# EAGLE schematic nets_v2 (EAGLE 9.6.2)
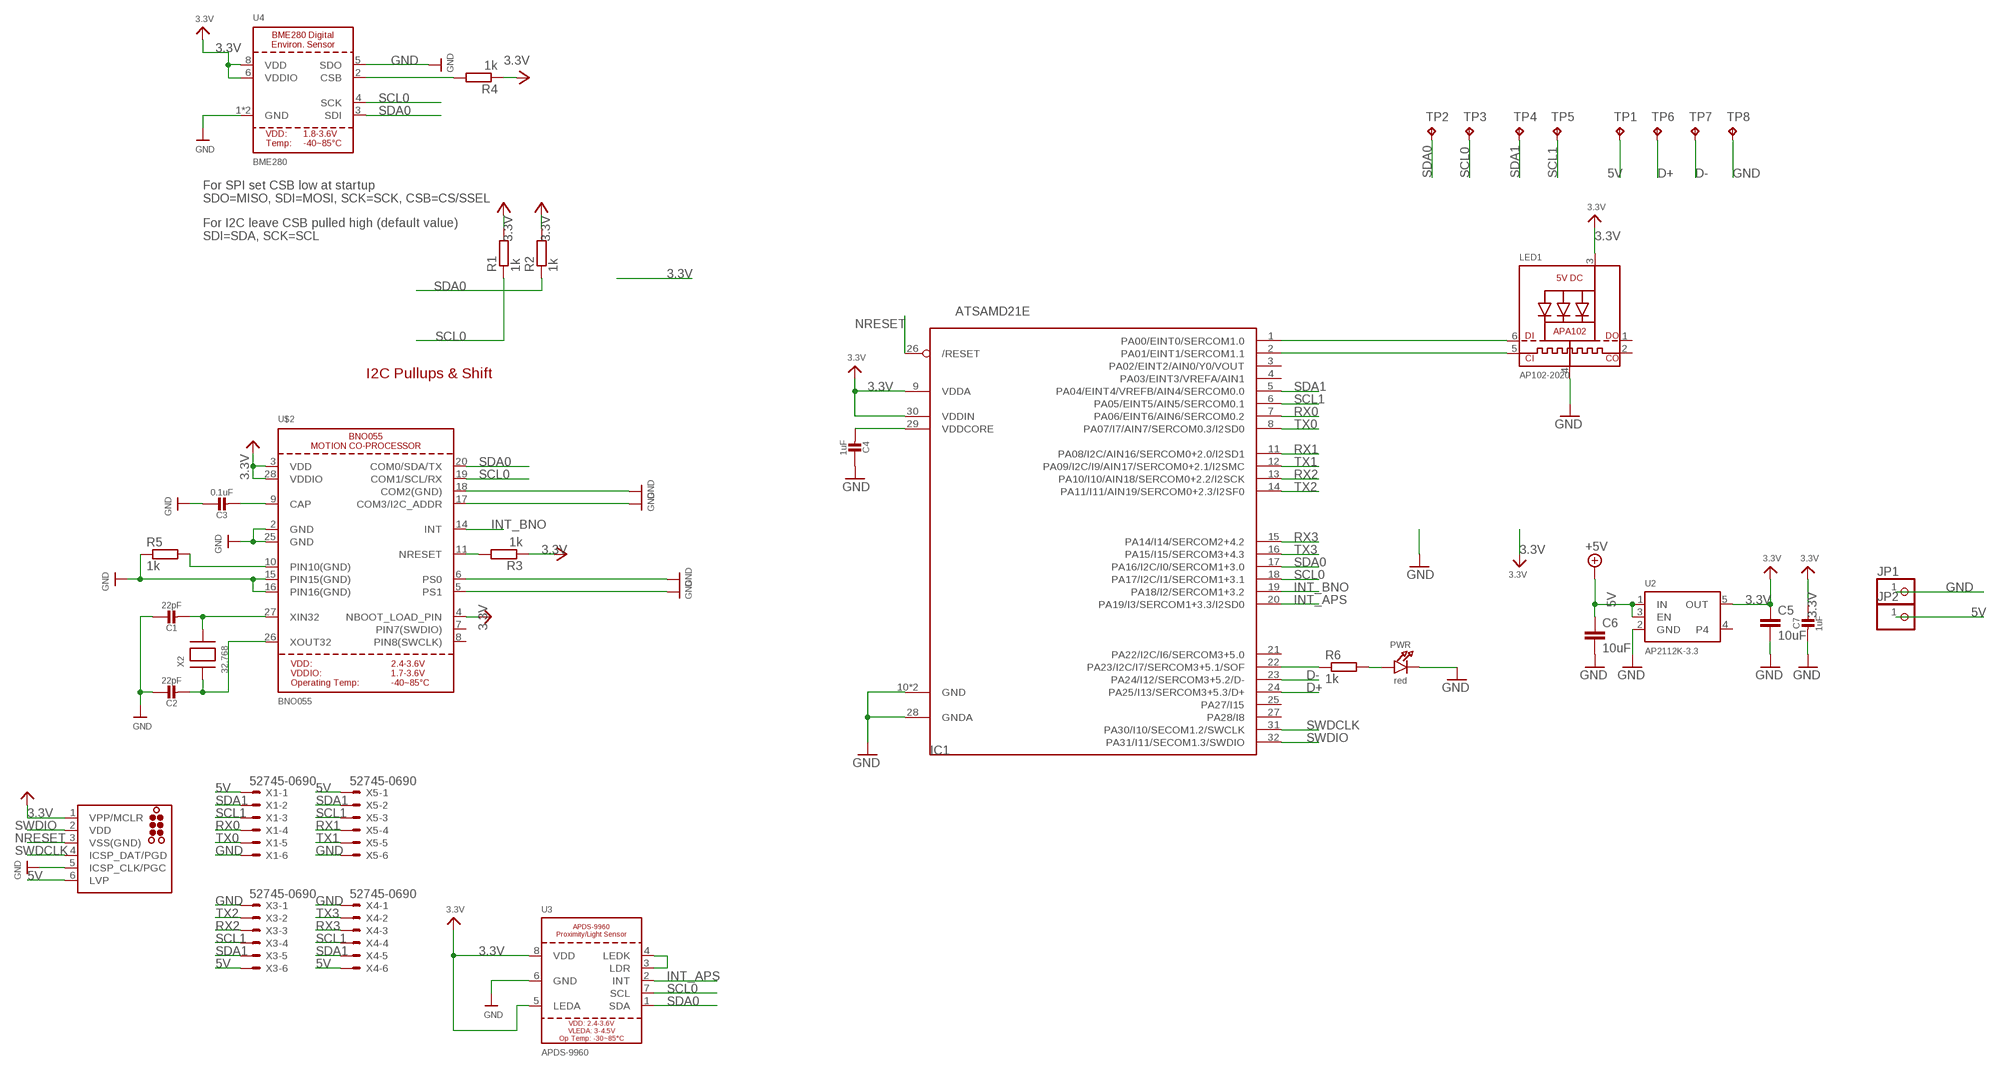
[diagram p0: schematic, sheet 1]

## Parts
C1  22pF  CAP_CERAMIC_0402NO  [_0402NO]
C2  22pF  CAP_CERAMIC_0402NO  [_0402NO]
C3  0.1uF  CAP_CERAMIC_0402NO  [_0402NO]
C4  1uF  CAP_CERAMIC_0402NO  [_0402NO]
C5  10uF  C-EUC0603  [C0603]
C6  10uF  C-EUC0603  [C0603]
C7  1uF  CAP_CERAMIC_0402NO  [_0402NO]
IC1  ATSAMD21E  [QFN32_5MM]
J1  TC2030-ICSP-MCP-NL  [TC2030-MCP-NL]
JP1  PINHD-1X1  [1X01]
JP2  PINHD-1X1  [1X01]
LED1  AP102-2020  APA1022020  [APA102_2020]
PWR  red  LED0603_NOOUTLINE  [CHIPLED_0603_NOOUTLINE]
R1  1k  R-EU_R0402  [R0402]
R2  1k  R-EU_R0402  [R0402]
R3  1k  R-EU_R0402  [R0402]
R4  1k  R-EU_R0402  [R0402]
R5  1k  R-EU_R0402  [R0402]
R6  1k  R-EU_R0402  [R0402]
TP1  TPTP10R  [TP10R]
TP2  TPTP10R  [TP10R]
TP3  TPTP10R  [TP10R]
TP4  TPTP10R  [TP10R]
TP5  TPTP10R  [TP10R]
TP6  TPTP10R  [TP10R]
TP7  TPTP10R  [TP10R]
TP8  TPTP10R  [TP10R]
U2  AP2112K-3.3  VREG_SOT23-5  [SOT23-5]
U3  APDS-9960  [APDS-9960]
U4  BME280  [BME280]
U$2  BNO055  [BNO055]
X1  52745-0690  [52745-0690]
X2  32.768  XTAL-3.2X1.5  [XTAL3215]
X3  52745-0690  [52745-0690]
X4  52745-0690  [52745-0690]
X5  52745-0690  [52745-0690]

## Nets
3.3V: C5.1 C7.1 IC1.9(VDDA) IC1.30(VDDIN) J1.1(VPP/MCLR) LED1.3(VDD) R1.2 R2.2 R3.1 R4.1 U2.5(OUT) U3.5(LEDA) U3.8(VDD) U4.6(VDDIO) U4.8(VDD) U$2.3(VDD) U$2.4(NBOOT_LOAD_PIN) U$2.28(VDDIO) ; supply symbol labelled VCC
5V [power]: C6.1 J1.6(LVP) JP2.1 TP1.TP U2.1(IN) U2.3(EN) X1.1 X3.6 X4.6 X5.1 ; supply symbol labelled +5V
D+: IC1.24(PA25/I13/SERCOM3+5.3/D+) TP6.TP
D-: IC1.23(PA24/I12/SERCOM3+5.2/D-) TP7.TP
GND: C1.1 C2.1 C3.1 C4.1 C5.2 C6.2 C7.2 IC1.10(GND) IC1.28(GNDA) IC1.33(GND) J1.5(ICSP_CLK/PGC) JP1.1 LED1.4(GND) PWR.C R5.1 TP8.TP U2.2(GND) U3.6(GND) U4.1(GND) U4.5(SDO) U4.7(GND) U$2.2(GND) U$2.5(PS1) U$2.6(PS0) U$2.15(PIN15(GND)) U$2.16(PIN16(GND)) U$2.17(COM3/I2C_ADDR) U$2.18(COM2(GND)) U$2.25(GND) X1.6 X3.1 X4.1 X5.6
INT_APS: IC1.20(PA19/I3/SERCOM1+3.3/I2SD0) U3.2(INT)
INT_BNO: IC1.19(PA18/I2/SERCOM1+3.2) U$2.14(INT)
N$1: C1.2 U$2.27(XIN32) X2.P$2
N$2: C2.2 U$2.26(XOUT32) X2.P$1
N$3: C3.2 U$2.9(CAP)
N$4: PWR.A R6.2
N$5: U3.3(LDR) U3.4(LEDK)
N$6: R5.2 U$2.10(PIN10(GND))
N$8: R3.2 U$2.11(NRESET)
N$9: R4.2 U4.2(CSB)
N$14: IC1.1(PA00/EINT0/SERCOM1.0) LED1.6(DI)
N$18: IC1.22(PA23/I2C/I7/SERCOM3+5.1/SOF) R6.1
N$20: IC1.2(PA01/EINT1/SERCOM1.1) LED1.5(CKI)
NRESET: IC1.26(/RESET) J1.3(VSS(GND))
RX0: IC1.7(PA06/EINT6/AIN6/SERCOM0.2) X1.4
RX1: IC1.11(PA08/I2C/AIN16/SERCOM0+2.0/I2SD1) X5.4
RX2: IC1.13(PA10/I10/AIN18/SERCOM0+2.2/I2SCK) X3.3
RX3: IC1.15(PA14/I14/SERCOM2+4.2) X4.3
SCL0: IC1.18(PA17/I2C/I1/SERCOM1+3.1) R1.1 TP3.TP U3.7(SCL) U4.4(SCK) U$2.19(COM1/SCL/RX)
SCL1: IC1.6(PA05/EINT5/AIN5/SERCOM0.1) TP5.TP X1.3 X3.4 X4.4 X5.3
SDA0: IC1.17(PA16/I2C/I0/SERCOM1+3.0) R2.1 TP2.TP U3.1(SDA) U4.3(SDI) U$2.20(COM0/SDA/TX)
SDA1: IC1.5(PA04/EINT4/VREFB/AIN4/SERCOM0.0) TP4.TP X1.2 X3.5 X4.5 X5.2
SWDCLK: IC1.31(PA30/I10/SECOM1.2/SWCLK) J1.4(ICSP_DAT/PGD)
SWDIO: IC1.32(PA31/I11/SECOM1.3/SWDIO) J1.2(VDD)
TX0: IC1.8(PA07/I7/AIN7/SERCOM0.3/I2SD0) X1.5
TX1: IC1.12(PA09/I2C/I9/AIN17/SERCOM0+2.1/I2SMC) X5.5
TX2: IC1.14(PA11/I11/AIN19/SERCOM0+2.3/I2SF0) X3.2
TX3: IC1.16(PA15/I15/SERCOM3+4.3) X4.2
VDDCORE: C4.2 IC1.29(VDDCORE)
Unconnected: IC1.3(PA02/EINT2/AIN0/Y0/VOUT) IC1.4(PA03/EINT3/VREFA/AIN1) IC1.21(PA22/I2C/I6/SERCOM3+5.0) IC1.25(PA27/I15) IC1.27(PA28/I8) LED1.1(DO) LED1.2(CKO) U2.4 U$2.7(PIN7(SWDIO)) U$2.8(PIN8(SWCLK))

## Notes on the sheet
- For SPI set CSB low at startup
  SDO=MISO, SDI=MOSI, SCK=SCK, CSB=CS/SSEL
- For I2C leave CSB pulled high (default value)
  SDI=SDA, SCK=SCL
- I2C Pullups & Shift

## Library data of the parts
C1 C2 = microbuilder:CAP_CERAMIC: Ceramic Capacitors For new designs, use the packages preceded by an '_' character since they are more reliable: The following footprints should be used on most boards: _0402 - Standard footprint for regular board layouts _0603 - Standard footprint for regular board layouts _0805 - Standard footprint for regular board layouts _1206 - Standard footprint for regular board layouts For extremely tight-pitch boards where space is at a premium, the following 'micro-pitch' footprints can be used (smaller pads, no silkscreen outline, etc.): _0402MP - Micro-pitch footprint for very dense/compact boards _0603MP - Micro-pitch footprint for very dense/compact boards _0805MP - Micro-pitch footprint for very dense/compact boards _1206MP - Micro-pitch footprint for very dense/compact boards; MF: WURTH ELEKTRONIK; MPN: 885012005042; OC_NEWARK: 04AJ6077
C3 = microbuilder:CAP_CERAMIC: Ceramic Capacitors For new designs, use the packages preceded by an '_' character since they are more reliable: The following footprints should be used on most boards: _0402 - Standard footprint for regular board layouts _0603 - Standard footprint for regular board layouts _0805 - Standard footprint for regular board layouts _1206 - Standard footprint for regular board layouts For extremely tight-pitch boards where space is at a premium, the following 'micro-pitch' footprints can be used (smaller pads, no silkscreen outline, etc.): _0402MP - Micro-pitch footprint for very dense/compact boards _0603MP - Micro-pitch footprint for very dense/compact boards _0805MP - Micro-pitch footprint for very dense/compact boards _1206MP - Micro-pitch footprint for very dense/compact boards; MF: KEMET; MPN: R79IC3100Z340J; OC_NEWARK: 58Y5428
C4 C7 = microbuilder:CAP_CERAMIC: Ceramic Capacitors For new designs, use the packages preceded by an '_' character since they are more reliable: The following footprints should be used on most boards: _0402 - Standard footprint for regular board layouts _0603 - Standard footprint for regular board layouts _0805 - Standard footprint for regular board layouts _1206 - Standard footprint for regular board layouts For extremely tight-pitch boards where space is at a premium, the following 'micro-pitch' footprints can be used (smaller pads, no silkscreen outline, etc.): _0402MP - Micro-pitch footprint for very dense/compact boards _0603MP - Micro-pitch footprint for very dense/compact boards _0805MP - Micro-pitch footprint for very dense/compact boards _1206MP - Micro-pitch footprint for very dense/compact boards; OC_NEWARK: unknown
C5 C6 = rcl:C-EU: CAPACITOR, European symbol; SPICEPREFIX: C
IC1 = microbuilder:ATSAMD21E; OC_NEWARK: unknown
J1 = tag-connect-2030:TC2030-ICSP: TAG-CONNECT ICSP Connector Manufacturer: Tag-Connect <http://www.tag-connect.com> Cable for easy In-Circuit Serial Programming. Designed for Microchip ICD2, suitable for many others. Two variants - one "with legs" (for hands-free fit on PCB) and another "without legs" for quick programming. PAD Description 1 MCLR/Vpp 2 Vdd 3 GND 4 PGD (ISPDAT) 5 PGC (ISPCLK) 6 nc (used for LVP) ©2009 ROFA.cz - modified and updated by Robert Darlington ‹rdarlington@gmail.com›; OC_NEWARK: unknown
JP1 JP2 = pinhead:PINHD-1X1: PIN HEADER
LED1 = microbuilder:APA102: APA102/DotStar Pixels VCC: 5V DC Refresh Rate: 400Hz
PWR = microbuilder:LED: LED 0603 - 0603 Surface Mount Package 2mA: Green LED - Low Power (3.9mcd, 2ma, 1.7Vf) - Digikey: 475-2709-2-ND Orange LED - Low Power (9.8mcd, 2ma, 1.8Vf) - Digikey: 475-1194-2-ND Red LED - Low Power (5mcd, 2ma, 1.8Vf) - Digikey: 475-1195-2-ND Yellow LED - Low Power (7mcd, 2ma, 1.8Vf) - Digikey: 475-1196-2-ND 5mA: Blue LED - Low Power (17mcd, 5ma, 2.9Vf) - Digikey: LNJ937W8CRACT-ND 0805 - 0805 Surface Mount Package 2mA: Red LED (8.8mcd, 2mA, 1.8Vf, Clear) - Low Power [Digikey: 475-2510-1-ND] Green LED (5mcd, 2mA, 1.8Vf, Clear) - Low Power [Digikey: 475-2730-1-ND] Yellow LED (11.3mcd, 2mA, 1.8Vf, Clear) - Low Power [Digikey: 475-2555-1-ND] 20mA: Red LED (104mcd, 20mA, Diffused) - LS R976 [Digikey: 475-1278-6-ND] Red LED (12mcd, 20mA, 2.0Vf, Clear) - APT2012EC [Digikey: 754-1128-1-ND] Green LED (15mcd, 20mA, 2.2Vf, Clear) - APT2012GC [Digikey: 754-1131-1-ND] Orange LED (160mcd, 20mA, 2.1Vf, Clear) - APT2012SECK [Digikey: 754-1130-1-ND] 1206 - 1206 Surface Mount Package Green LED (26mcd, 20mA, Diffused) - LG N971 [Digikey: 475-1407-6-ND] Red LED (15mcd, 20mA, Diffused) - LH N974 [Digikey: 475-1416-6-ND] Cree - Cree High-Power Surface Mount LEDs XPEBWT-L1-0000-00D50 - White 111lm 350mA 2.9Vf 6200K 110° XTEAWT-00-0000-00000LEE3 - White 114lm 350mA 2.85Vf 5000K 115° Everlight - Everlight 45-21 Series Surface Mount LEDs 45-21/QK2C-B2832AC2CB2/2T - Warm White 2000mcd 20mA 3.25Vf 3050K 120° 45-21/LK2C-B38452C4CB2/2T - Nuetral White 2000mcd 20mA 3.25Vf 4150K 120° 45-21/LK2C-B50634C6CB2/2T - Cold White 2200mcd 20mA 3.25Vf 5650K 120° PLCC2 Reverse Mount LS T77K-J1L2-1-0-2-R18-Z - Red 11.25mcd 2mA 1.8Vf 630nm 120° LO T77K-L1M2-24-Z - Orange 19.6mcd 2mA 1.8Vf 606nm 120° LY T77K-K2M1-26-Z - Yellow 15.7mcd 2mA 1.8Vf 587nm 120°; OC_NEWARK: unknown
R1-R6 = rcl:R-EU_: RESISTOR, European symbol; OC_NEWARK: unknown; SPICEPREFIX: R
TP1-TP8 = testpad:TP: Test pad; OC_NEWARK: unknown
U2 = adafruit_power:VREG_SOT23-5: SOT23-5 Fixed Voltage Regulators Part Current Out V Out V In V Dropout θJA (°C/W) TJ (°C) Digikey Part No. ADP121 150mA 3.3V 3.4-5.5V 0.09V @ 150mA -- -- ADP121-AUJZ33R7CT-ND ADP121 150mA 3.0V 3.1-5.5V 0.09V @ 150mA -- -- ADP121-AUJZ30R7CT-ND ADP122 300mA 3.3V 3.4-5.5V 0.085V @ 300mA -- -- ADP122AUJZ-3.3-R7CT-ND ADP1712 300mA 3.3V 3.5-5.5V 0.17V @ 300mA -- -- ADP1712AUJZ-3.3-R7TR-ND AP7311 (Low Cost) 150mA 3.3V 3.5-6V 0.15V @ 150mA -- -- AP7311-33WG-7DICT-ND LD39015M18R 150mA 1.8V 1.9V-5.5V 0.08V @ 100mA -- -- 497-6977-1-ND LP2985A-33DBVR 150mA 3.3V 3.3-16V 0.28V @ 150mA 206 150 296-18479-1-ND MCP1824T-3302E/OT 300mA 3.3V 3.5V-6V 0.2V @ 300mA -- -- MCP1824T-3302E/OTCT-ND MIC5205-2.5YM5 TR 150mA 2.5V 2.7-16V 0.165V @ 150mA -- -- 576-1257-2-ND MIC5205-3.0YM5 TR 150mA 3.0V 3.2V-16V 0.165V @ 150mA -- -- 576-1258-2-ND MIC5205-3.3YM5 TR 150mA 3.3V 3.5V-16V 0.165V @ 150mA -- -- 576-1259-2-ND TPS780330220 150mA 3.3V+2.2V 3.6-5.5V 250mV Max -- -- 296-23332-1-ND TDA3663/N1,135 100mA 3.3V 3.5-45V 0.18V @ 50mA -- -- 568-5343-1-ND Max operating temp can be calculated using θJA, TJ (max junction temperature), and power in watts. Set the "Maximum Ambient Temperature" until it reaches TJ ("Max Junction Temperature"), which is the absolute limit for safe use of the regulator: Heat Sink Temperature Calculator <http://www.daycounter.com/Calculators/Heat-Sink-Temperature-Calculator.phtml> For example, With 12V source into a 3.3V LP2985 and a 30mA load, we are dissipating (12V-3.3V) * 0.03A = 0.261W. With a θJA of 206 °C/W, a TJ of 150°C, and 261mW we can safely use the chip without a heat sink up to 75°C (=147.1°C Junction Temperature).; OC_NEWARK: unknown
U3 = microbuilder:APDS-9960: APDS-9960 - Digital Proximity Sensor with Ambient Light/RGB/Gesture Detection; OC_NEWARK: unknown
U4 = microbuilder:BME280: BME280 - Environmental Sensor (I2C + SPI)
U$2 = microbuilder:BNO055: BNO055 - Motion Co-Processor; OC_NEWARK: unknown
X1 X3-X5 = con-molex:52745-0690: FFC/FPC-to-Board 0.50mm (.020") SMT Top Contact Right Angle, ZIF, Style Receptacle 52745 / 52435 Source: http://www.molex.com/product/ffc/52745.html; MF: MOLEX; MPN: 52745-0690; OC_FARNELL: unknown; OC_NEWARK: unknown
X2 = adafruit2:XTAL: Low cost SMT crystals, no capacitors included http://www.ladyada.net/library/eagle; OC_NEWARK: unknown

## Net classes
1 power: width 0.254 mm
2 lowpower: width 0.305 mm, drill 0.483 mm